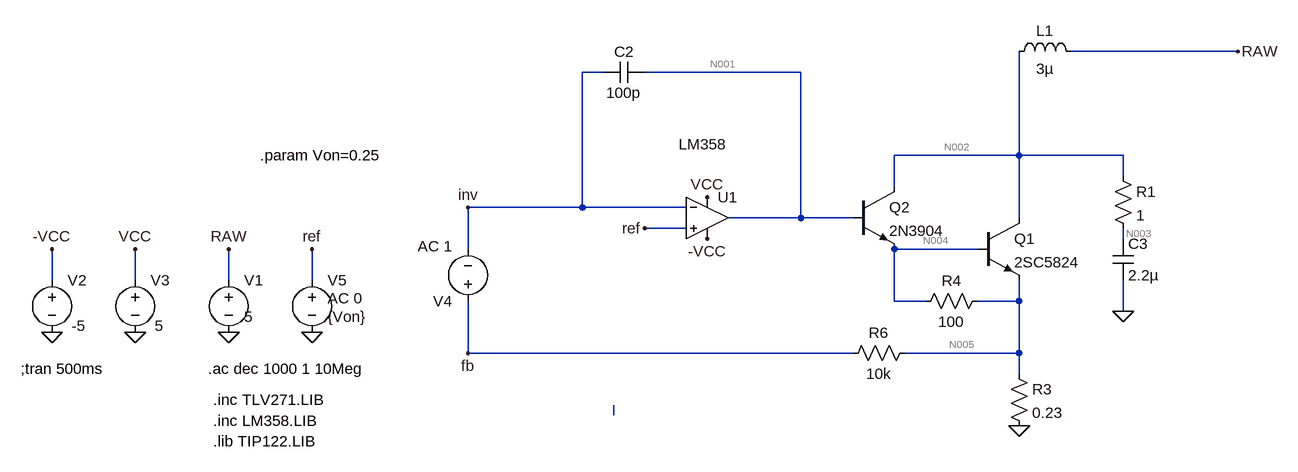
[diagram p0: schematic bjt-stability.asc]
bjt-stability.asc, the LTspice schematic file:
Version 4
SHEET 1 1508 680
WIRE 1024 -240 768 -240
WIRE 48 -208 16 -208
WIRE 352 -208 112 -208
WIRE 688 -80 688 -240
WIRE 688 -80 496 -80
WIRE 848 -80 688 -80
WIRE 848 -48 848 -80
WIRE 496 -32 496 -80
WIRE 16 0 16 -208
WIRE 16 0 -160 0
WIRE 176 0 16 0
WIRE 352 16 352 -208
WIRE 352 16 240 16
WIRE 432 16 352 16
WIRE 688 16 688 -80
WIRE 176 32 112 32
WIRE 848 48 848 32
WIRE -160 64 -160 0
WIRE 624 64 496 64
WIRE -800 112 -800 64
WIRE -672 112 -672 64
WIRE -528 112 -528 64
WIRE -400 112 -400 64
WIRE 496 144 496 64
WIRE 544 144 496 144
WIRE 688 144 688 112
WIRE 688 144 624 144
WIRE 848 160 848 112
WIRE -160 224 -160 144
WIRE 432 224 -160 224
WIRE 688 224 688 144
WIRE 688 224 512 224
WIRE 688 256 688 224
WIRE 64 320 64 304
FLAG -528 192 0
FLAG -528 64 RAW
FLAG 208 -16 VCC
FLAG -672 192 0
FLAG -672 64 VCC
FLAG -160 224 fb
FLAG 688 336 0
FLAG 1024 -240 RAW
FLAG -800 192 0
FLAG -800 64 -VCC
FLAG 208 48 -VCC
FLAG -400 192 0
FLAG -400 64 ref
FLAG 112 32 ref
FLAG -160 0 inv
FLAG 848 160 0
SYMBOL voltage -528 96 R0
WINDOW 123 24 44 Left 2
WINDOW 39 0 0 Left 0
WINDOW 3 24 72 Left 2
SYMATTR Value 5
SYMATTR InstName V1
SYMBOL OpAmps\\opamp2 208 -48 R0
WINDOW 3 -44 -49 Left 2
SYMATTR Value LM358
SYMATTR InstName U1
SYMBOL voltage -672 96 R0
WINDOW 123 24 44 Left 2
WINDOW 39 0 0 Left 0
WINDOW 3 30 86 Left 2
SYMATTR Value 5
SYMATTR InstName V3
SYMBOL voltage -160 160 R180
WINDOW 123 24 100 Left 2
WINDOW 39 0 0 Left 0
WINDOW 3 24 128 Left 2
SYMATTR Value2 AC 1
SYMATTR Value ""
SYMATTR InstName V4
SYMBOL res 672 240 R0
SYMATTR InstName R3
SYMATTR Value 0.23
SYMBOL voltage -800 96 R0
WINDOW 123 24 44 Left 2
WINDOW 39 0 0 Left 0
WINDOW 3 30 86 Left 2
SYMATTR Value -5
SYMATTR InstName V2
SYMBOL voltage -400 96 R0
WINDOW 123 24 44 Left 2
WINDOW 39 0 0 Left 0
WINDOW 3 24 72 Left 2
SYMATTR Value2 AC 0
SYMATTR Value {Von}
SYMATTR InstName V5
SYMBOL ind 672 -224 R270
WINDOW 0 32 56 VTop 2
WINDOW 3 5 56 VBottom 2
SYMATTR InstName L1
SYMATTR Value 3µ
SYMBOL cap 112 -224 R90
WINDOW 0 0 32 VBottom 2
WINDOW 3 32 32 VTop 2
SYMATTR InstName C2
SYMATTR Value 100p
SYMBOL res 528 208 R90
WINDOW 0 0 56 VBottom 2
WINDOW 3 32 56 VTop 2
SYMATTR InstName R6
SYMATTR Value 10k
SYMBOL cap 832 48 R0
SYMATTR InstName C3
SYMATTR Value 2.2µ
SYMBOL res 832 -64 R0
SYMATTR InstName R1
SYMATTR Value 1
SYMBOL res 640 128 R90
WINDOW 0 0 56 VBottom 2
WINDOW 3 32 56 VTop 2
SYMATTR InstName R4
SYMATTR Value 100
SYMBOL npn 624 16 R0
SYMATTR InstName Q1
SYMATTR Value 2SC5824
SYMBOL npn 432 -32 R0
SYMATTR InstName Q2
SYMATTR Value 2N3904
TEXT -560 248 Left 2 !.ac dec 1000 1 10Meg
TEXT -552 296 Left 2 !.inc TLV271.LIB
TEXT -552 328 Left 2 !.inc LM358.LIB
TEXT -848 248 Left 2 !;tran 500ms
TEXT -552 360 Left 2 !.lib TIP122.LIB
TEXT -480 -80 Left 2 !.param Von=0.25

The netlist it stands for:
* bjt-stability.asc
V1 RAW 0 5
XU1 ref inv VCC -VCC N001 LM358  ; pins In+ In- V+ V- OUT
V3 VCC 0 5
V4 fb inv AC 1
R3 N005 0 0.23
V2 -VCC 0 -5
V5 ref 0 {Von} AC 0
L1 N002 RAW 3µ
C2 N001 inv 100p
R6 N005 fb 10k
C3 N003 0 2.2µ
R1 N002 N003 1
R4 N005 N004 100
Q1 N002 N004 N005 0 2SC5824
Q2 N002 N001 N004 0 2N3904
.model NPN NPN
.model PNP PNP
.lib standard.bjt
.ac dec 1000 1 10Meg
.inc TLV271.LIB
.inc LM358.LIB
;tran 500ms
.lib TIP122.LIB
.param Von=0.25
.backanno
.end

* Results of the author's LTspice run, read from the files saved beside the schematic
* Operating Point, zero values left out:
*   V(raw) = 5 V
*   V(n001) = 1.738 V
*   V(vcc) = 5 V
*   V(-vcc) = -5 V
*   V(inv) = 250.3 mV
*   V(ref) = 250 mV
*   V(fb) = 250.3 mV
*   V(n005) = 250.2 mV
*   V(n002) = 4.999 V
*   V(n003) = 4.999 V
*   V(n004) = 1.013 V
*   Ic(Q1) = 1.074 A
*   Ib(Q1) = 6.207 mA
*   Ie(Q1) = -1.08 A
*   Ic(Q2) = 13.78 mA
*   Ib(Q2) = 45.98 µA
*   Ie(Q2) = -13.83 mA
*   I(L1) = -1.088 A
*   I(R3) = 1.088 A
*   I(R6) = -9.5 nA
*   I(R4) = -7.624 mA
*   I(V1) = -1.088 A
*   I(V3) = -346 µA
*   I(V4) = -9.5 nA
*   I(V2) = 300 µA
*   I(V5) = 10 nA
*   Ix(u1:IN+) = -10 nA
*   Ix(u1:IN-) = -9.5 nA
*   Ix(u1:VCC) = 346 µA
*   Ix(u1:VEE) = -300 µA
*   Ix(u1:OUT) = -45.98 µA
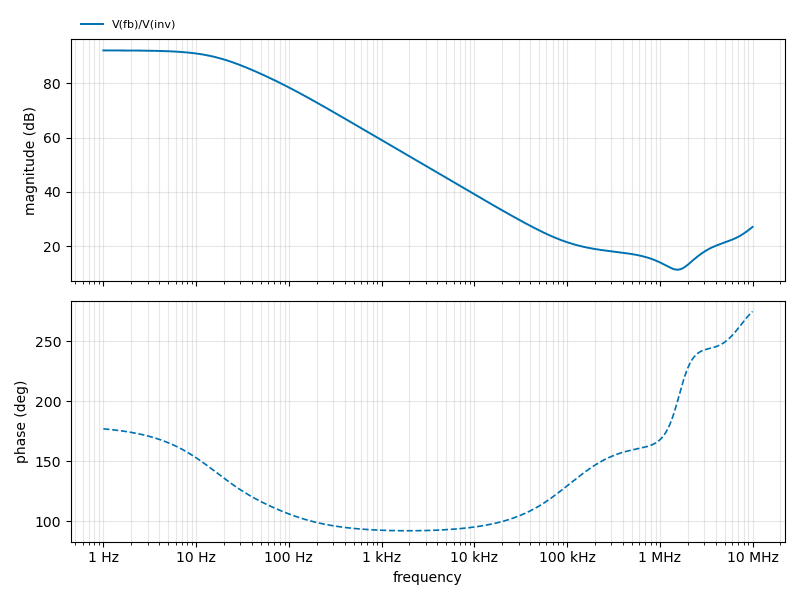
[diagram p1: AC Analysis of bjt-stability.asc, plotted from the saved traces]
* AC Analysis, 1 run:
*   V(fb)/V(inv): 92.09 dB at 1 Hz, 27.13 dB at 10 MHz, peak 92.09 dB at 1 Hz, 3 dB below the peak at 18.54 Hz